# Altium schematic sheet Display.SchDoc
size 297 x 209 mm
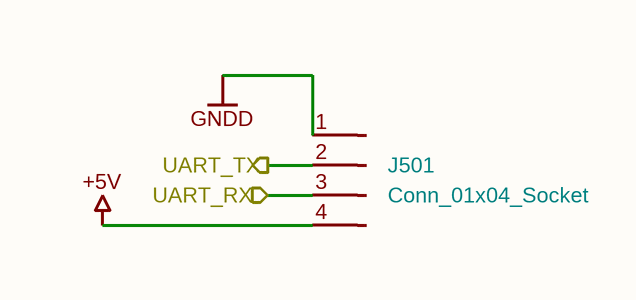
[diagram p0: Display.SchDoc]

## Parts
J501  Conn_01x04_Socket  [JST_XH_B4B-XH-A_1x04_P2.50mm_Vertical]

## Ports
UART_RX (in), UART_TX (out)

## Nets
+5V: J501.4(Pin_4)
GNDD: J501.1(Pin_1)
UART_RX: J501.3(Pin_3) ; port UART_RX
UART_TX: J501.2(Pin_2) ; port UART_TX

## Notes on the sheet
- THIS DOCUMENT AND THE DATA DISCLOSED HEREIN OR
- HEREWITH IS THE PROPERTY OF TEAM HAYA OFF ROADING AND MAY
- NOT BE FREELY DISTRIBUTED IN WHOLE. ALL RIGHTS ARE
- RESERVED AND NO EXPRESS OR IMPLIED WARANTEE IS GIVEN.

## Library data of the parts
J501 = Conn_01x04_Socket: Value: Conn_01x04_Socket; Footprint: Connector_JST:JST_XH_B4B-XH-A_1x04_P2.50mm_Vertical